# EAGLE design Electronicsmb (EAGLE 9.1.1)
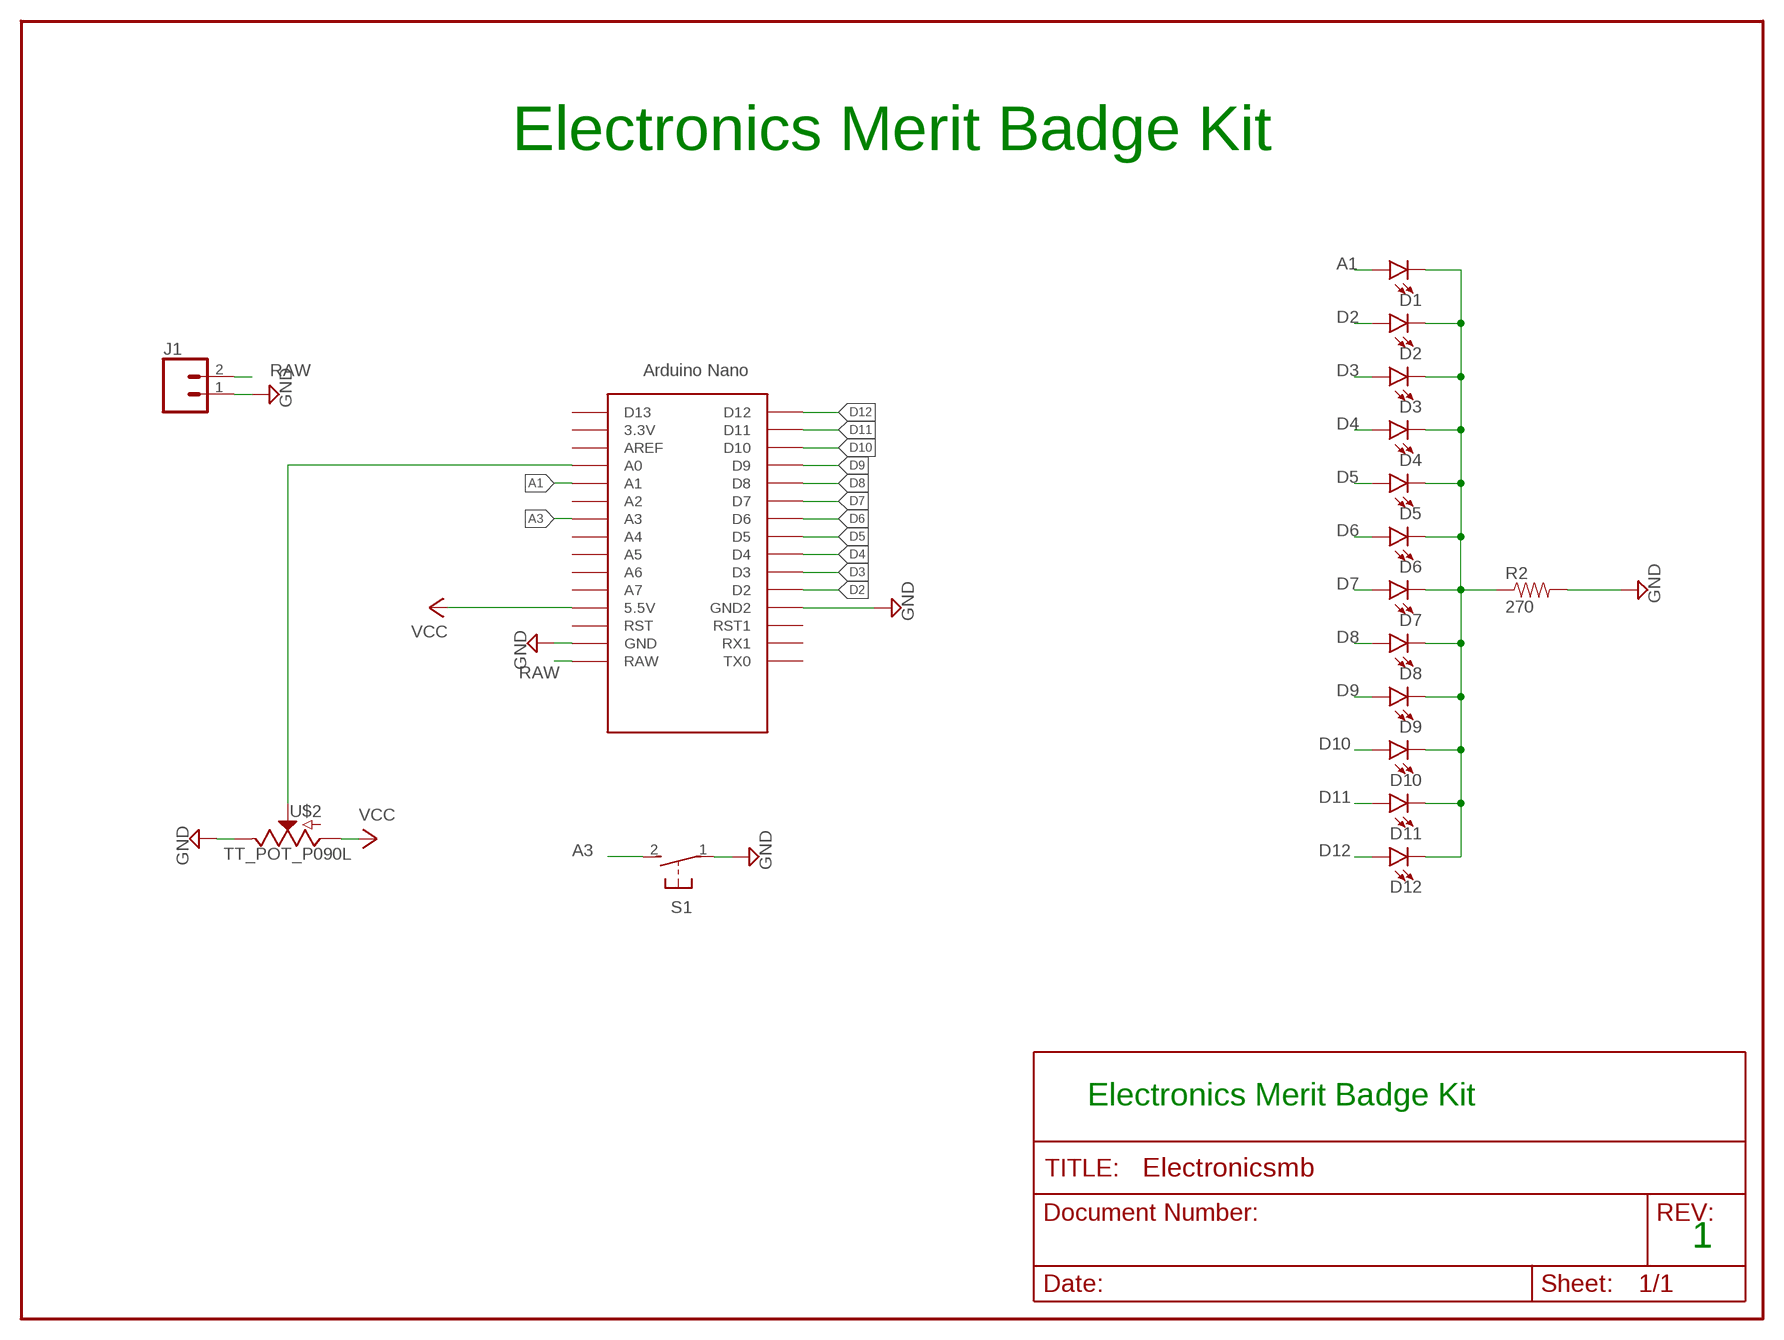
[diagram p0: schematic, sheet 1]

## Parts
D1  LED5MM  [LED_5MM]
D2  LED5MM  [LED_5MM]
D3  LED5MM  [LED_5MM]
D4  LED5MM  [LED_5MM]
D5  LED5MM  [LED_5MM]
D6  LED5MM  [LED_5MM]
D7  LED5MM  [LED_5MM]
D8  LED5MM  [LED_5MM]
D9  LED5MM  [LED_5MM]
D10  LED5MM  [LED_5MM]
D11  LED5MM  [LED_5MM]
D12  LED5MM  [LED_5MM]
J1  CONN_02  [1X02]
R2  270  RESISTORPTH-1/4W  [AXIAL-0.4]
S1  31-XX  [B3F-31XX]
U$1  NANO  [NANO]
U$2  TT_POT_P090L  [TT_POT]

## Nets
A1: D1.A U$1.A1
A3: S1.2(S) U$1.A3
D2: D2.A U$1.D2
D3: D3.A U$1.D3
D4: D4.A U$1.D4
D5: D5.A U$1.D5
D6: D6.A U$1.D6
D7: D7.A U$1.D7
D8: D8.A U$1.D8
D9: D9.A U$1.D9
D10: D10.A U$1.D10
D11: D11.A U$1.D11
D12: D12.A U$1.D12
GND: J1.1 R2.P$2 S1.1(P) U$1.GND U$1.GND1(GND2) U$2.P$3(E)
N$2: D1.K(C) D2.K(C) D3.K(C) D4.K(C) D5.K(C) D6.K(C) D7.K(C) D8.K(C) D9.K(C) D10.K(C) D11.K(C) D12.K(C) R2.P$1
N$27: U$1.A0 U$2.P$2(S)
RAW: J1.2 U$1.RAW
VCC: U$1.5V(5.5V) U$2.P$1(A)
Unconnected: U$1.3.3V U$1.A2 U$1.A4 U$1.A5 U$1.A6 U$1.A7 U$1.AREF U$1.D13 U$1.ICSP1 U$1.ICSP2 U$1.ICSP3 U$1.ICSP4 U$1.ICSP5 U$1.ICSP6 U$1.RST U$1.RST1 U$1.RX1 U$1.TX0

## Notes on the sheet
- Electronics Merit Badge Kit
- Electronics Merit Badge Kit
- 1

## Library data of the parts
D1-D12 = SparkFun-LED:LED: LED (Generic) Standard schematic elements and footprints for 5mm, 3mm, 1206, and 0603 sized LEDs. Generic LEDs with no color specified.
J1 = SparkFun-Connectors:CONN_02: Multi connection point. Often used as Generic Header-pin footprint for 0.1 inch spaced/style header connections On any of the 0.1 inch spaced packages, you can populate with these: Break Away Headers - Straight <https://www.sparkfun.com/products/116> (PRT-00116) Break Away Male Headers - Right Angle <https://www.sparkfun.com/products/553> (PRT-00553) Female Headers <https://www.sparkfun.com/products/115> (PRT-00115) Break Away Headers - Machine Pin <https://www.sparkfun.com/products/117> (PRT-00117) Break Away Female Headers - Swiss Machine Pin <https://www.sparkfun.com/products/743> (PRT-00743) For SCREWTERMINALS and SPRING TERMINALS visit here: Screw Terimnals on SparkFun.com <https://www.sparkfun.com/search/results?term=Screw+Terminals> (5mm/3.5mm/2.54mm spacing) This device is also useful as a general connection point to wire up your design to another part of your project. Our various solder wires solder well into these plated through hole pads. Hook-Up Wire - Assortment (Stranded, 22 AWG) <https://www.sparkfun.com/products/11375> (PRT-11375) Hook-Up Wire - Assortment (Solid Core, 22 AWG) <https://www.sparkfun.com/products/11367> (PRT-11367) View the entire wire category on our website here <https://www.sparkfun.com/categories/141> Special notes: Molex polarized connector foot print use with: PRT-08233 with associated crimp pins and housings. 2.54_SCREWTERM for use with PRT-10571. 3.5mm Screw Terminal footprints for PRT-08084 5mm Screw Terminal footprints for use with PRT-08432
R2 = SparkFun:RESISTOR: Resistor Basic schematic elements and footprints for 0603, 1206, and PTH resistors.
S1 = switch-omron:31-XX: OMRON SWITCH; MPN: B3F-3100; OC_FARNELL: 959704; OC_NEWARK: 36M3582
U$1 = Arduino-clone:NANO: Arduino Nano
U$2 = homemadehamcustom:TT_POT_P090L

## Board
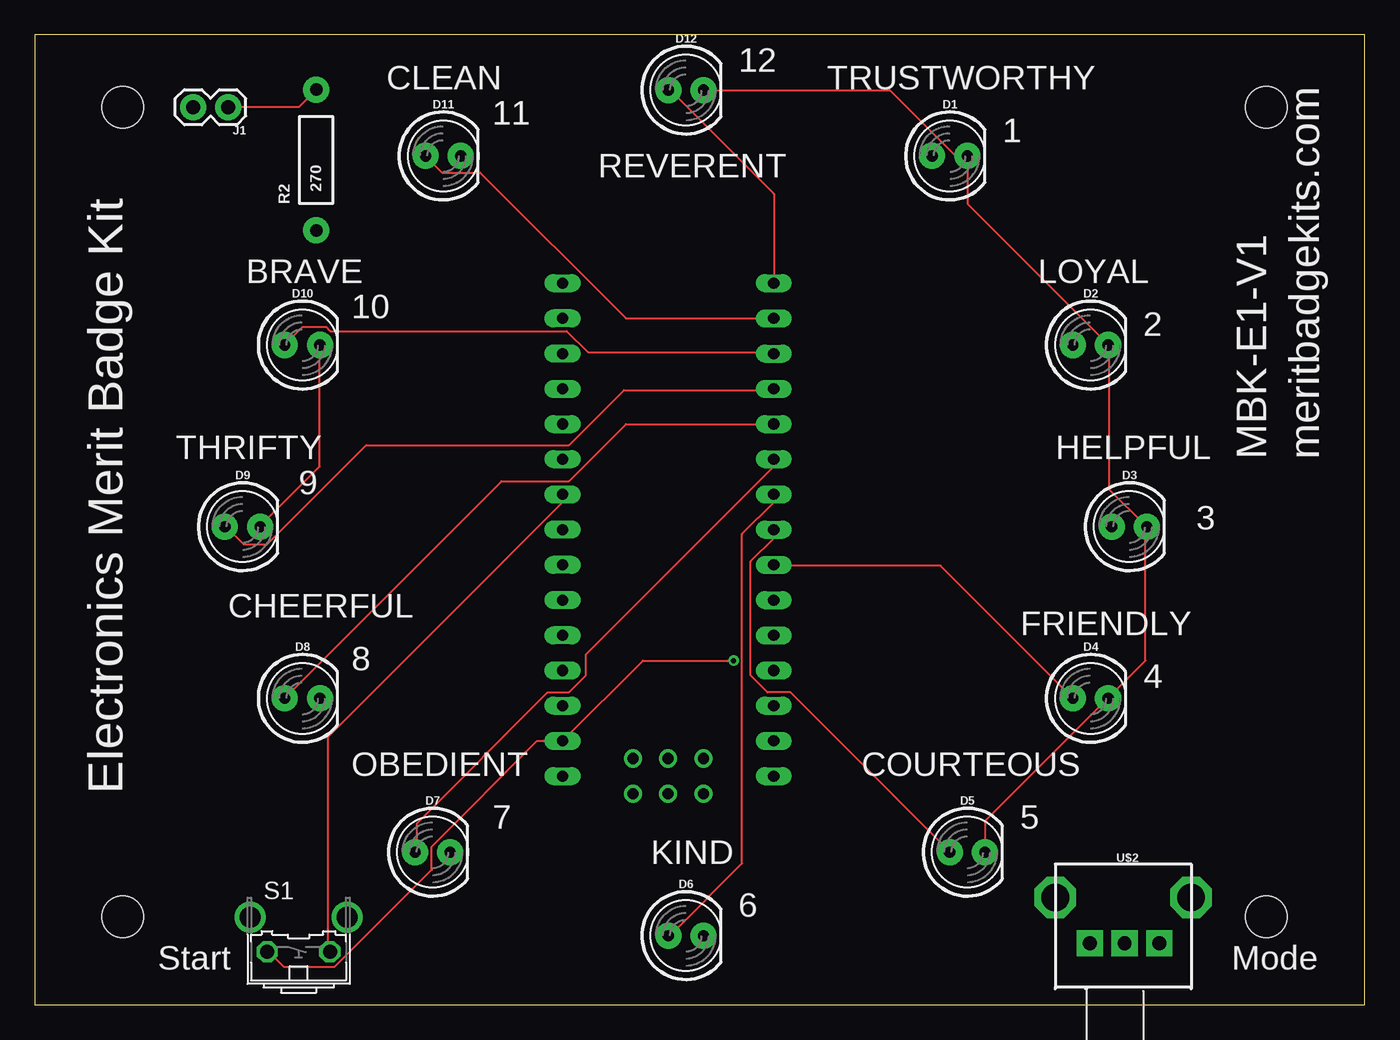
[diagram p1: board, top side]
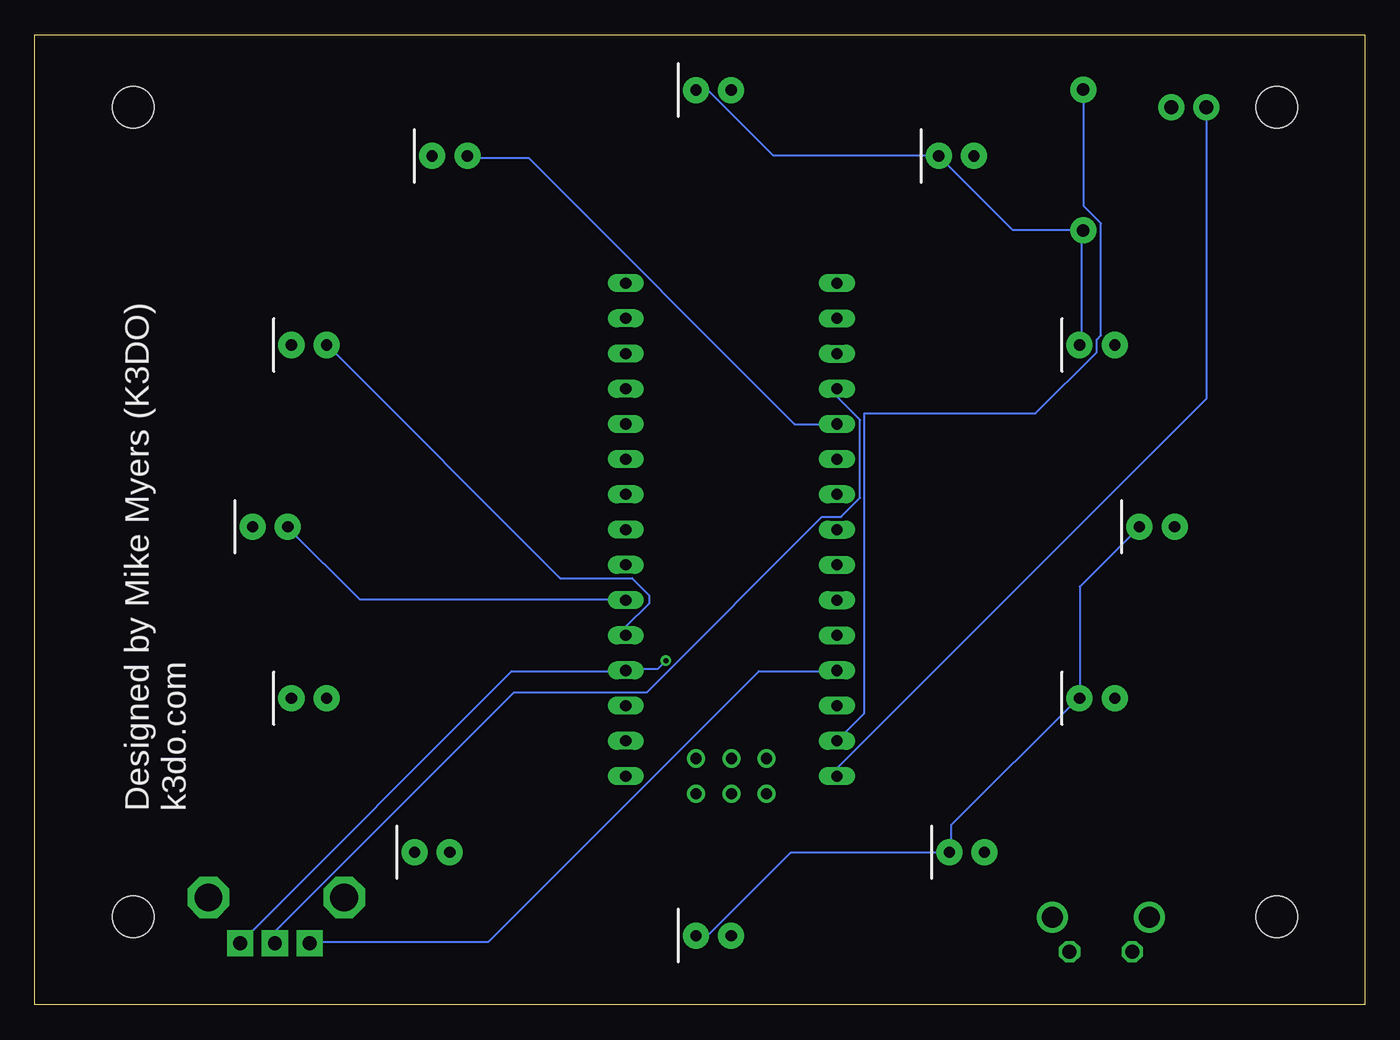
[diagram p2: board, bottom side, seen from below]

Size 96 x 70 mm. Coordinates in mm from the lower left corner, seen from the top.
Outline: 0,0 96,0 96,70 0,70 0,0
Copper layers (1*16): Top 0.035mm / dielectric 1.5mm / Bottom 0.035mm
Design rules "default": minimum track width 6mil, minimum drill 0.35mm, track to track 6mil, track to pad 6mil, pad to pad 6mil, via to via 6mil, smd to smd 6mil, copper to edge 40mil, drill to drill 6mil, minimum pad ring 10mil, minimum via ring 8mil, stop-mask expansion 4mil, vias tented up to drill 0mil, thermal gap 10mil
Holes 3 mm at 6.35,6.35 6.35,64.77 88.9,64.77 88.9,6.35

### Footprints (pad centres in the part's own frame; a part is rotated, then mirrored left to right if it is on the bottom)
LED_5MM = drill 0.813 pad 1.88: A -1.27,0; K 1.27,0
1X02 = drill 1.016 pad 1.88: 1 0,0; 2 2.54,0
AXIAL-0.4 = drill 0.9 pad 1.88: P$1 -5.08,0; P$2 5.08,0
B3F-31XX = drill 1.016 octagon: 1 -2.261,-1.245; 2 2.261,-1.245 | drill 1.499 pad 2.159: 3 -3.505,1.245; 4 3.505,1.245
NANO = drill 0.8 long: 3.3V -10.16,24.13; 5V -10.16,-1.27; A0 -10.16,19.05; A1 -10.16,16.51; A2 -10.16,13.97; A3 -10.16,11.43; A4 -10.16,8.89; A5 -10.16,6.35; A6 -10.16,3.81; A7 -10.16,1.27; AREF -10.16,21.59; D2 5.08,1.27; D3 5.08,3.81; D4 5.08,6.35; D5 5.08,8.89; D6 5.08,11.43; D7 5.08,13.97; D8 5.08,16.51; D9 5.08,19.05; D10 5.08,21.59; D11 5.08,24.13; D12 5.08,26.67; D13 -10.16,26.67; GND -10.16,-6.35; GND1 5.08,-1.27; RAW -10.16,-8.89; RST -10.16,-3.81; RST1 5.08,-3.81; RX1 5.08,-6.35; TX0 5.08,-8.89 | drill 0.8: ICSP1 -5.08,-10.16; ICSP2 -5.08,-7.62; ICSP3 -2.54,-10.16; ICSP4 -2.54,-7.62; ICSP5 0,-10.16; ICSP6 0,-7.62
TT_POT = drill 1 pad 1.88 square: P$1 5.7,2.5; P$2 5.7,5; P$3 5.7,7.5 | drill 2 octagon: P$4 2.4,0; P$5 2.4,9.8

### Placement (x,y rotation side)
D1  66.04,61.25 0 top
D2  76.2,47.61 0 top
D3  79,34.5 0 top
D4  76.2,22.12 0 top
D5  67.31,11.02 0 top
D6  47,5 0 top
D7  28.72,11.02 0 top
D8  19.32,22.12 0 top
D9  15,34.5 0 top
D10  19.32,47.61 0 top
D11  29.48,61.25 0 top
D12  47,66 0 top
J1  13.97,64.77 180 top
R2  20.32,60.96 90 top
S1  19.05,5.08 0 top
U$1  48.26,25.4 0 top
U$2  73.66,10.16 270 top

### Tracks (layer width: path | path; a pad name or v marks a point on that pad's centre or on a via)
A1
  Bottom 0.152: U$1.A1 41.15,41.91 60.35,61.11 64.77,61.11 D1.A
A3
  Top 0.152: U$1.A3 38.1,36.73 38.1,36.27 21.18,19.36 21.18,3.96 S1.2
D2
  Bottom 0.152: U$1.D2 53.34,27.28 51.66,28.96 51.66,29.57 52.88,30.79 58.06,30.79 74.83,47.55 D2.A
D3
  Bottom 0.152: U$1.D3 53.34,29.26 72.54,29.26 77.72,34.44 D3.A
D4
  Top 0.152: U$1.D4 53.34,31.7 65.38,31.7 74.83,22.25 D4.A
D5
  Top 0.152: U$1.D5 53.34,33.68 51.66,32 51.66,23.77 52.88,22.55 54.56,22.55 65.99,11.12 D5.A
D6
  Top 0.152: U$1.D6 53.34,36.73 53.34,36.27 51.05,33.98 51.05,10.21 45.87,5.03 D6.A
D7
  Top 0.152: U$1.D7 53.34,39.32 53.34,38.86 39.78,25.3 39.78,23.77 38.56,22.55 37.03,22.55 27.58,13.11 27.58,11.12 D7.A
D8
  Top 0.152: U$1.D8 42.67,41.91 38.56,37.8 33.68,37.8 18.14,22.25 D8.A
D9
  Top 0.152: U$1.D9 53.34,44.35 42.52,44.35 38.56,40.39 23.93,40.39 16.76,33.22 15.09,33.22 13.87,34.44 D9.A
D10
  Top 0.152: U$1.D10 53.34,47.09 39.93,47.09 38.41,48.62 21.34,48.62 21.03,48.92 19.36,48.92 18.14,47.7 D10.A
D11
  Top 0.152: U$1.D11 42.67,49.53 32.16,60.05 29.41,60.05 28.35,61.11 D11.A
D12
  Top 0.152: U$1.D12 53.34,52.12 53.34,58.52 45.87,65.99 D12.A
GND  (via drill 0.35)
  Top 0.152: 14.02,64.77 J1.1 14.02,64.77 | S1.1 16.92,3.81 17.98,2.74 21.64,2.74 28.65,9.75 28.65,11.43 36.27,19.05 U$1.GND 43.89,24.84 v50.44,24.84 | 14.02,64.77 19.05,64.77 20.27,65.99 R2.P$2
  Bottom 0.152: U$2.P$3 81.08,4.57 61.57,24.08 53.34,24.08 U$1.GND1 53.34,24.23 51.05,24.23 v50.44,24.84 | U$1.GND 36.12,21.03 36.12,42.67 23.77,42.67 19.36,47.09 19.36,48.01 19.05,48.31 19.05,56.39 20.27,57.61 20.27,65.99 R2.P$2
N$2
  Top 0.152: D5.K 68.58,11.12 68.58,13.26 77.42,22.1 D4.K 77.57,22.25 80.16,24.84 80.16,34.44 D3.K 80.16,34.59 77.57,37.19 77.57,47.55 D2.K 77.42,47.7 67.36,57.76 67.36,61.11 D1.K 67.21,61.27 66.45,61.27 61.72,65.99 48.31,65.99 D12.K | 29.87,61.27 30.63,61.27 D11.K | D10.K 20.57,47.55 20.57,38.86 16.31,34.59 D9.K
  Bottom 0.152: 20.42,47.85 20.57,47.7 D10.K 20.42,47.85 | D12.K 48.16,65.99 47.4,65.99 42.67,61.27 30.79,61.27 D11.K 30.63,61.11 25.45,55.93 20.42,55.93 R2.P$1 20.42,55.78 20.42,47.85 | D9.K 16.31,34.44 20.57,30.18 20.57,22.25 D8.K 20.73,22.1 29.87,12.95 29.87,11.12 D7.K 30.02,10.97 41.45,10.97 47.4,5.03 48.16,5.03 D6.K
N$27
  Bottom 0.152: U$1.A0 38.1,44.35 38.1,43.89 36.42,42.22 36.42,36.58 37.8,35.2 39.17,35.2 51.82,22.55 61.42,22.55 78.64,5.33 78.64,4.57 U$2.P$2
RAW
  Bottom 0.152: J1.2 11.43,43.74 38.1,17.07 38.1,16.61 U$1.RAW
VCC
  Bottom 0.152: U$1.5V 38.1,24.08 43.74,24.08 63.25,4.57 76.05,4.57 U$2.P$1

### Text on the board
tPlace: CLEAN | 11
tNames: 12 | TRUSTWORTHY | 1 | REVERENT | BRAVE | LOYAL | 10 | 2 | THRIFTY | HELPFUL | MBK-E1-V1 | meritbadgekits.com | 9 | 3 | CHEERFUL | FRIENDLY | 8 | 4 | OBEDIENT | COURTEOUS | Electronics Merit Badge Kit | 7 | 5 | KIND | 6 | Start | Mode
bNames: Designed by Mike Myers (K3DO) / k3do.com